# EAGLE design EDS Board v2 (EAGLE 9.5.0)
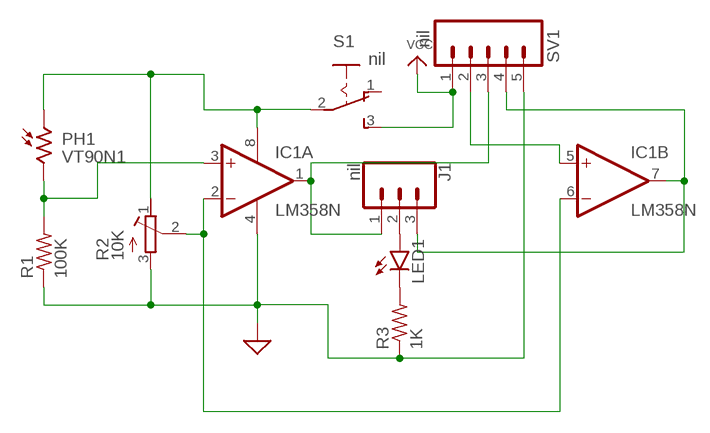
[diagram p0: schematic, sheet 1]

## Parts
IC1  LM358N  [DIL08]
J1  nil  CONN_03  [1X03]
LED1  RED  LED5MM  [LED5MM]
PH1  VT90N1  [VT900]
R1  100K  R-US_0207/7  [0207/7]
R2  10K  R-TRIMMT93YA  [RTRIMT93YA]
R3  1K  R-US_0207/7  [0207/7]
S1  nil  255SB  [255SB]
SV1  nil  CONN_05  [1X05]

## Nets
GND: IC1.4(P:V-) R1.1 R2.3(A) R3.1 SV1.5 ; supply symbol labelled SUP
N$1: IC1.2(A:-IN) IC1.6(B:-IN) R2.2(S)
N$2: IC1.3(A:+IN) PH1.2 R1.2
N$3: IC1.1(A:OUT) J1.1 SV1.3
N$5: LED1.K(C) R3.2
N$6: IC1.7(B:OUT) J1.3 SV1.4
N$7: IC1.5(B:+IN) SV1.2
N$8: IC1.8(P:V+) PH1.1 R2.1(E) S1.2(P)
N$9: J1.2 LED1.A
VCC: S1.3(S) SV1.1
Unconnected: S1.1(O)

## Library data of the parts
IC1 = linear_mod:LM358: OP AMP also LM158; LM258; LM2904 Source: http://cache.national.com/ds/LM/LM158.pdf
J1 = SparkFun-Connectors:CONN_03: Multi connection point. Often used as Generic Header-pin footprint for 0.1 inch spaced/style header connections On any of the 0.1 inch spaced packages, you can populate with these: Break Away Headers - Straight <https://www.sparkfun.com/products/116> (PRT-00116) Break Away Male Headers - Right Angle <https://www.sparkfun.com/products/553> (PRT-00553) Female Headers <https://www.sparkfun.com/products/115> (PRT-00115) Break Away Headers - Machine Pin <https://www.sparkfun.com/products/117> (PRT-00117) Break Away Female Headers - Swiss Machine Pin <https://www.sparkfun.com/products/743> (PRT-00743) Stackable Header - 3 Pin (Female, 0.1") <https://www.sparkfun.com/products/13875> (PRT-13875) For SCREWTERMINALS and SPRING TERMINALS visit here: Screw Terimnals on SparkFun.com <https://www.sparkfun.com/search/results?term=Screw+Terminals> (5mm/3.5mm/2.54mm spacing) This device is also useful as a general connection point to wire up your design to another part of your project. Our various solder wires solder well into these plated through hole pads. Hook-Up Wire - Assortment (Stranded, 22 AWG) <https://www.sparkfun.com/products/11375> (PRT-11375) Hook-Up Wire - Assortment (Solid Core, 22 AWG) <https://www.sparkfun.com/products/11367> (PRT-11367) View the entire wire category on our website here <https://www.sparkfun.com/categories/141> Special notes: Molex polarized connector foot print use with SKU : PRT-08232 with associated crimp pins and housings.
LED1 = led_edited:LED: LED OSRAM: - CHIPLED LG R971, LG N971, LY N971, LG Q971, LY Q971, LO R971, LY R971 LH N974, LH R974 LS Q976, LO Q976, LY Q976 LO Q996 - Hyper CHIPLED LW Q18S LB Q993, LB Q99A, LB R99A - SideLED LS A670, LO A670, LY A670, LG A670, LP A670 LB A673, LV A673, LT A673, LW A673 LH A674 LY A675 LS A676, LA A676, LO A676, LY A676, LW A676 LS A679, LY A679, LG A679 - Hyper Micro SIDELED® LS Y876, LA Y876, LO Y876, LY Y876 LT Y87S - SmartLED LW L88C, LW L88S LB L89C, LB L89S, LG L890 LS L89K, LO L89K, LY L89K LS L896, LA L896, LO L896, LY L896 - TOPLED LS T670, LO T670, LY T670, LG T670, LP T670 LSG T670, LSP T670, LSY T670, LOP T670, LYG T670 LG T671, LOG T671, LSG T671 LB T673, LV T673, LT T673, LW T673 LH T674 LS T676, LA T676, LO T676, LY T676, LB T676, LH T676, LSB T676, LW T676 LB T67C, LV T67C, LT T67C, LS T67K, LO T67K, LY T67K, LW E67C LS E67B, LA E67B, LO E67B, LY E67B, LB E67C, LV E67C, LT E67C LW T67C LS T679, LY T679, LG T679 LS T770, LO T770, LY T770, LG T770, LP T770 LB T773, LV T773, LT T773, LW T773 LH T774 LS E675, LA E675, LY E675, LS T675 LS T776, LA T776, LO T776, LY T776, LB T776 LHGB T686 LT T68C, LB T68C - Hyper Mini TOPLED® LB M676 - Mini TOPLED Santana® LG M470 LS M47K, LO M47K, LY M47K Source: http://www.osram.convergy.de LUXEON: - LUMILED® LXK2-PW12-R00, LXK2-PW12-S00, LXK2-PW14-U00, LXK2-PW14-V00 LXK2-PM12-R00, LXK2-PM12-S00, LXK2-PM14-U00 LXK2-PE12-Q00, LXK2-PE12-R00, LXK2-PE12-S00, LXK2-PE14-T00, LXK2-PE14-U00 LXK2-PB12-K00, LXK2-PB12-L00, LXK2-PB12-M00, LXK2-PB14-N00, LXK2-PB14-P00, LXK2-PB14-Q00 LXK2-PR12-L00, LXK2-PR12-M00, LXK2-PR14-Q00, LXK2-PR14-R00 LXK2-PD12-Q00, LXK2-PD12-R00, LXK2-PD12-S00 LXK2-PH12-R00, LXK2-PH12-S00 LXK2-PL12-P00, LXK2-PL12-Q00, LXK2-PL12-R00 Source: www.luxeon.com KINGBRIGHT: KA-3528ASYC Source: www.kingbright.com
PH1 = photo-elements_mod_2:VT9: Photoconductive Cell VT900 Series Source: http://optoelectronics.perkinelmer.com/content/Datasheets/DTS_vt900seriesdatasheet.pdf
R1 R3 = rcl_2:R-US_: RESISTOR, American symbol; SPICEPREFIX: R
R2 = rcl_trim pot edit:R-TRIMM: Trimm resistor; SPICEMODEL: X; SPICEPREFIXL: POT
S1 = switch:255SB: SLIDING SWITCH Distributor Buerklin, 11G810
SV1 = SparkFun-Connectors:CONN_05: Multi connection point. Often used as Generic Header-pin footprint for 0.1 inch spaced/style header connections On any of the 0.1 inch spaced packages, you can populate with these: Break Away Headers - Straight <https://www.sparkfun.com/products/116> (PRT-00116) Break Away Male Headers - Right Angle <https://www.sparkfun.com/products/553> (PRT-00553) Female Headers <https://www.sparkfun.com/products/115> (PRT-00115) Break Away Headers - Machine Pin <https://www.sparkfun.com/products/117> (PRT-00117) Break Away Female Headers - Swiss Machine Pin <https://www.sparkfun.com/products/743> (PRT-00743) For SCREWTERMINALS and SPRING TERMINALS visit here: Screw Terimnals on SparkFun.com <https://www.sparkfun.com/search/results?term=Screw+Terminals> (5mm/3.5mm/2.54mm spacing) This device is also useful as a general connection point to wire up your design to another part of your project. Our various solder wires solder well into these plated through hole pads. Hook-Up Wire - Assortment (Stranded, 22 AWG) <https://www.sparkfun.com/products/11375> (PRT-11375) Hook-Up Wire - Assortment (Solid Core, 22 AWG) <https://www.sparkfun.com/products/11367> (PRT-11367) View the entire wire category on our website here <https://www.sparkfun.com/categories/141> Special notes: Molex polarized connector foot print use with SKU : PRT-08231 with associated crimp pins and housings. 1MM SMD Version SKU: PRT-10208

## Board
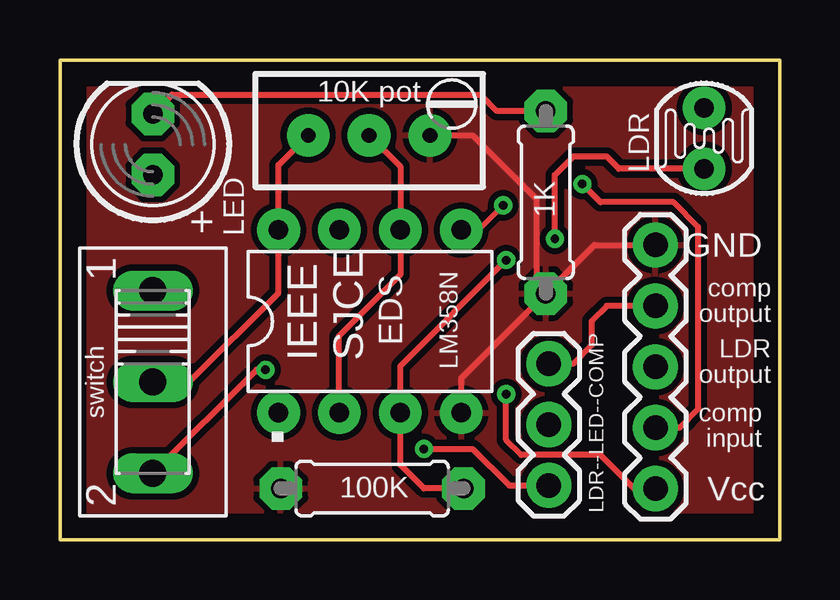
[diagram p1: board, top side]
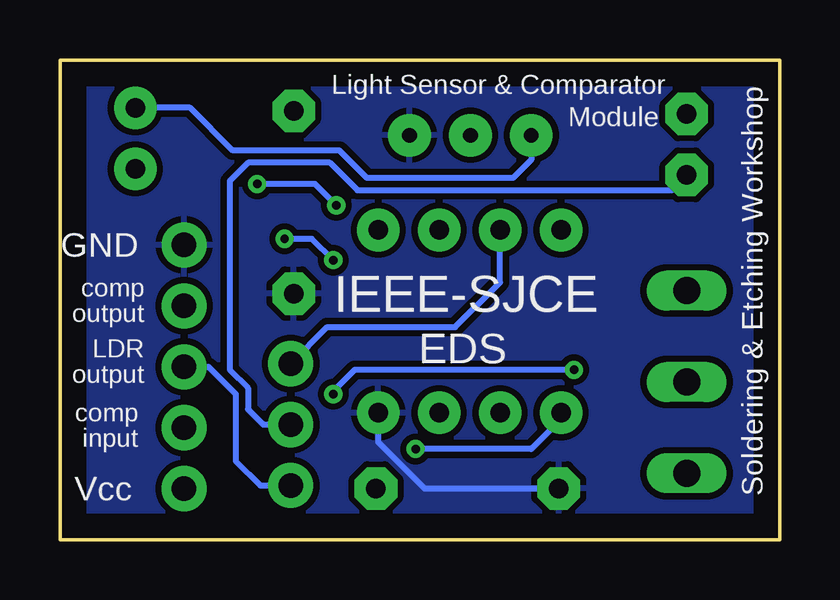
[diagram p2: board, bottom side, seen from below]

Size 30 x 20 mm. Coordinates in mm from the lower left corner, seen from the top.
Outline: 0,0 0,20 30,20 30,0 0,0
Copper layers (1*16): Top 0.035mm / dielectric 1.5mm / Bottom 0.035mm
Design rules "default": minimum track width 6mil, minimum drill 0.35mm, track to track 6mil, track to pad 6mil, pad to pad 6mil, via to via 6mil, smd to smd 6mil, copper to edge 40mil, drill to drill 6mil, minimum pad ring 10mil, minimum via ring 8mil, stop-mask expansion 4mil, vias tented up to drill 0mil, thermal gap 10mil

### Footprints (pad centres in the part's own frame; a part is rotated, then mirrored left to right if it is on the bottom)
DIL08 = drill 0.813 pad 1.778: 1 -3.81,-3.81; 2 -1.27,-3.81; 3 1.27,-3.81; 4 3.81,-3.81; 5 3.81,3.81; 6 1.27,3.81; 7 -1.27,3.81; 8 -3.81,3.81
1X03 = drill 1.016 pad 1.88: 1 0,0; 2 2.54,0; 3 5.08,0
LED5MM = drill 0.813 pad 1.778 octagon: A -1.27,0; K 1.27,0
VT900 = drill 0.8 pad 1.778: 1 -1.27,0; 2 1.27,0
0207/7 = drill 0.813 pad 1.778 octagon: 1 -3.81,0; 2 3.81,0
RTRIMT93YA = drill 0.61 pad 1.778: 1 0,-2.54; 2 0,0; 3 0,2.54
255SB = drill 1.118 long: 1 -3.81,0; 2 0,0; 3 3.81,0
1X05 = drill 1.016 pad 1.88: 1 0,0; 2 2.54,0; 3 5.08,0; 4 7.62,0; 5 10.16,0

### Placement (x,y rotation side)
IC1  12.92,9.1 0 top
J1  20.38,2.25 90 top
LED1  3.87,16.48 90 top
PH1  26.86,16.73 270 top
R1  13.01,2.13 0 top
R2  12.89,16.86 270 top
R3  20.25,14.06 90 top
S1  3.87,6.57 270 top
SV1  24.83,2.13 90 top

### Tracks (layer width: path | path; a pad name or v marks a point on that pad's centre or on a via)
GND
  Top 0.254: R3.1 22.29,12.29 SV1.5 | R2.3 17.21,16.86 19.87,14.19 19.87,10.63 R3.1 | IC1.4 16.73,6.73 R3.1
  Bottom 0.254: IC1.4 16.73,4.06 14.79,2.13 R1.1
  pour Top (isolate 0.254): -0.07,20.03 -0.07,-0.03 30.03,-0.03 30.03,20.03
  pour Bottom (isolate 0.254): -0.07,20.03 -0.07,-0.03 30.03,-0.03 30.03,20.03
N$1
  Top 0.203: IC1.6 14.19,12.79 | 11.62,5.32 IC1.2
  Top 0.254: 14.19,12.79 14.19,11.05 11.62,8.48 11.62,5.32 | R2.2 14.19,15.55 IC1.6
N$2  (via drill 0.35)
  Top 0.254: v18.6,11.65 14.19,7.24 IC1.3 14.19,3.11 15.17,2.13 R1.2 | PH1.2 23.3,15.46 22.79,15.97 21.4,15.97 20.63,15.21 v20.63,12.54
  Bottom 0.254: v18.6,11.65 19.49,12.54 v20.63,12.54
N$3  (via drill 0.35)
  Top 0.254: J1.1 18.73,2.25 17.21,3.78 v15.17,3.78
  Bottom 0.254: SV1.3 23.81,7.21 22.67,6.06 22.67,3.27 21.65,2.25 J1.1 | IC1.1 9.11,5.01 10.35,3.78 v15.17,3.78
N$5
  Top 0.254: R3.2 18.22,17.87 17.54,18.55 4.68,18.55 LED1.K
N$6
  Top 0.254: SV1.4 22.79,9.75 22.16,9.11 22.16,8.09 21.4,7.33 J1.3
  Bottom 0.254: J1.3 18.86,8.86 13.52,8.86 11.74,10.63 11.65,10.73 IC1.7
N$7  (via drill 0.35)
  Top 0.203: 17.45,12.91 v18.48,13.94
  Top 0.254: IC1.5 17.45,12.91 | v21.78,14.83 22.54,14.06 25.59,14.06 26.6,13.05 26.6,5.43 25.84,4.67 SV1.2
  Bottom 0.254: v21.78,14.83 19.36,14.83 v18.48,13.94
N$8
  Top 0.254: R2.1 9.11,15.62 IC1.8 9.11,10.29 5.39,6.57 S1.2
  Bottom 0.254: R2.1 10.35,15.84 11.11,15.08 17.21,15.08 18.35,16.22 22.79,16.22 24.57,18 PH1.1
N$9
  Bottom 0.254: LED1.A 4.51,14.57 17.6,14.57 18.75,15.72 22.16,15.72 22.92,14.95 22.92,7.08 22.16,6.32 22.16,5.43 21.52,4.79 J1.2
VCC  (via drill 0.35)
  Top 0.254: SV1.1 23.94,2.13 22.54,3.52 19.24,3.52 18.6,4.16 v18.6,6.06 | S1.3 8.19,7.08 v8.57,7.08
  Bottom 0.203: 18.6,6.19 v18.6,6.06
  Bottom 0.254: v8.57,7.08 17.71,7.08 18.6,6.19

### Text on the board
tNames: 10K pot | LDR | 1K | + | LED | GND | comp / output | LDR / output | EDS | IEEE / SJCE | comp / input | switch | . | Vcc | LDR--LED--COMP
bNames: Light Sensor & Comparator | Soldering & Etching Workshop | Module | GND | IEEE-SJCE | comp / output | EDS | LDR / output | comp / input | Vcc